# Altium schematic sheet P19 Connect.SchDoc
size 420 x 297 mm
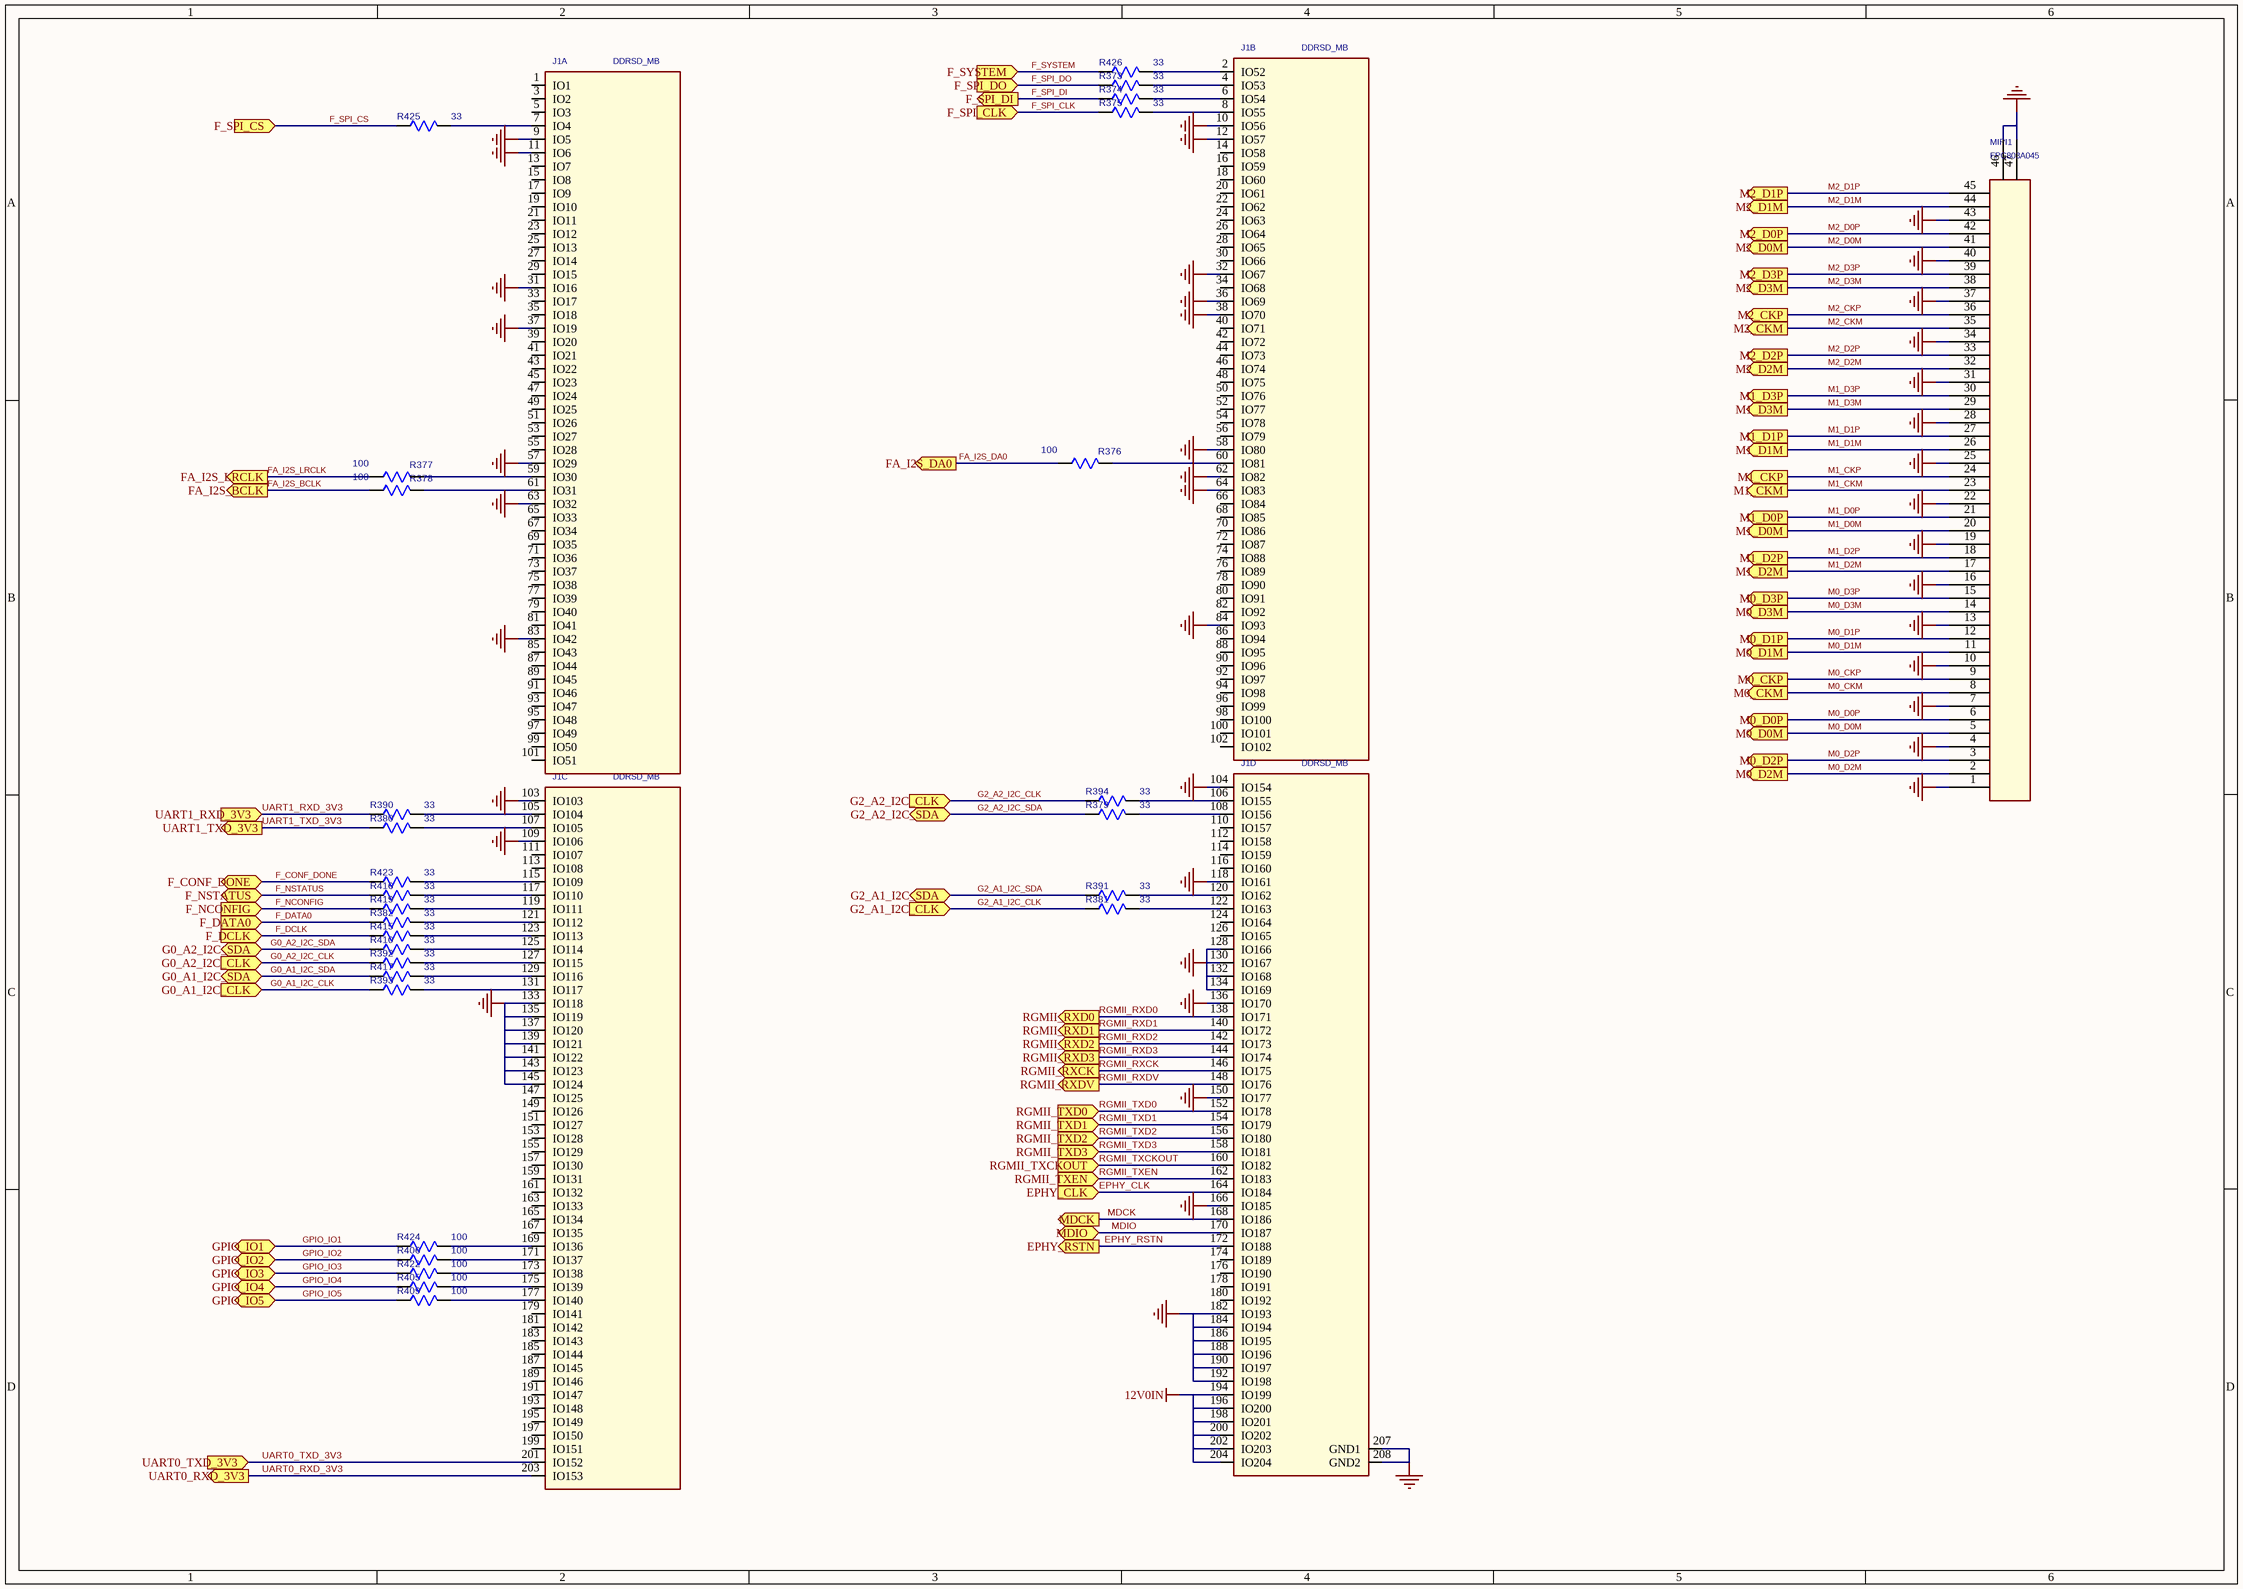
[diagram p0: P19 Connect.SchDoc]

## Parts
J1  DDRSD_MB  [DDR3SODI_MBH2S6]  (parts A,B,C,D of 4)
MIPI1  FPC803A045  [FPC803A045]
R373  33  [SR0402]
R374  33  [SR0402]
R375  33  [SR0402]
R376  100  [SR0402]
R377  100  [SR0402]
R378  100  [SR0402]
R379  33  [SR0402]
R380  33  [SR0402]
R381  33  [SR0402]
R382  33  [SR0402]
R390  33  [SR0402]
R391  33  [SR0402]
R392  33  [SR0402]
R393  33  [SR0402]
R394  33  [SR0402]
R405  100  [SR0402]
R406  100  [SR0402]
R409  100  [SR0402]
R410  33  [SR0402]
R415  33  [SR0402]
R416  33  [SR0402]
R417  33  [SR0402]
R419  33  [SR0402]
R422  100  [SR0402]
R423  33  [SR0402]
R424  100  [SR0402]
R425  33  [SR0402]
R426  33  [SR0402]

## Ports
EPHY_CLK, EPHY_RSTN, F_CONF_DONE, F_DATA0, F_DCLK, F_NCONFIG, F_NSTATUS, F_SPI_CLK, F_SPI_CS, F_SPI_DI, F_SPI_DO, F_SYSTEM, FA_I2S_BCLK, FA_I2S_DA0, FA_I2S_LRCLK, G0_A1_I2C_CLK, G0_A1_I2C_SDA, G0_A2_I2C_CLK, G0_A2_I2C_SDA, G2_A1_I2C_CLK, G2_A1_I2C_SDA, G2_A2_I2C_CLK, G2_A2_I2C_SDA, GPIO_IO1, GPIO_IO2, GPIO_IO3, GPIO_IO4, GPIO_IO5, M0_CKM, M0_CKP, M0_D0M, M0_D0P, M0_D1M, M0_D1P, M0_D2M, M0_D2P, M0_D3M, M0_D3P, M1_CKM, M1_CKP, M1_D0M, M1_D0P, M1_D1M, M1_D1P, M1_D2M, M1_D2P, M1_D3M, M1_D3P, M2_CKM, M2_CKP, M2_D0M, M2_D0P, M2_D1M, M2_D1P, M2_D2M, M2_D2P, M2_D3M, M2_D3P, MDCK, MDIO, RGMII_RXCK, RGMII_RXD0, RGMII_RXD1, RGMII_RXD2, RGMII_RXD3, RGMII_RXDV, RGMII_TXCKOUT, RGMII_TXD0, RGMII_TXD1, RGMII_TXD2, RGMII_TXD3, RGMII_TXEN, UART0_RXD_3V3, UART0_TXD_3V3, UART1_RXD_3V3, UART1_TXD_3V3

## Nets
12V0IN: J1.194(IO199) J1.196(IO200) J1.198(IO201) J1.200(IO202) J1.202(IO203) J1.204(IO204)
GND: J1.9(IO5) J1.10(IO56) J1.11(IO6) J1.12(IO57) J1.31(IO16) J1.32(IO67) J1.36(IO69) J1.37(IO19) J1.38(IO70) J1.57(IO29) J1.58(IO80) J1.62(IO82) J1.63(IO32) J1.64(IO83) J1.83(IO42) J1.84(IO93) J1.103(IO103) J1.104(IO154) J1.109(IO106) J1.118(IO161) J1.128(IO166) J1.130(IO167) J1.132(IO168) J1.133(IO118) J1.134(IO169) J1.135(IO119) J1.136(IO170) J1.137(IO120) J1.139(IO121) J1.141(IO122) J1.143(IO123) J1.145(IO124) J1.150(IO177) J1.166(IO185) J1.182(IO193) J1.184(IO194) J1.186(IO195) J1.188(IO196) J1.190(IO197) J1.192(IO198) J1.207(GND1) J1.208(GND2) MIPI1.1 MIPI1.4 MIPI1.7 MIPI1.10 MIPI1.13 MIPI1.16 MIPI1.19 MIPI1.22 MIPI1.25 MIPI1.28 MIPI1.31 MIPI1.34 MIPI1.37 MIPI1.40 MIPI1.43 MIPI1.46 MIPI1.47
EPHY_CLK: J1.164(IO184) ; port EPHY_CLK
EPHY_RSTN: J1.172(IO188) ; port EPHY_RSTN
F_CONF_DONE: R423.1(A) ; port F_CONF_DONE
F_DATA0: R382.1(A) ; port F_DATA0
F_DCLK: R415.1(A) ; port F_DCLK
F_NCONFIG: R419.1(A) ; port F_NCONFIG
F_NSTATUS: R416.1(A) ; port F_NSTATUS
F_SPI_CLK: R375.1(A) ; port F_SPI_CLK
F_SPI_CS: R425.1(A) ; port F_SPI_CS
F_SPI_DI: R374.1(A) ; port F_SPI_DI
F_SPI_DO: R373.1(A) ; port F_SPI_DO
F_SYSTEM: R426.1(A) ; port F_SYSTEM
FA_I2S_BCLK: R378.2(B) ; port FA_I2S_BCLK
FA_I2S_DA0: R376.2(B) ; port FA_I2S_DA0
FA_I2S_LRCLK: R377.2(B) ; port FA_I2S_LRCLK
G0_A1_I2C_CLK: R393.1(A) ; port G0_A1_I2C_CLK
G0_A1_I2C_SDA: R417.1(A) ; port G0_A1_I2C_SDA
G0_A2_I2C_CLK: R392.1(A) ; port G0_A2_I2C_CLK
G0_A2_I2C_SDA: R410.1(A) ; port G0_A2_I2C_SDA
G2_A1_I2C_CLK: R381.1(A) ; port G2_A1_I2C_CLK
G2_A1_I2C_SDA: R391.1(A) ; port G2_A1_I2C_SDA
G2_A2_I2C_CLK: R394.1(A) ; port G2_A2_I2C_CLK
G2_A2_I2C_SDA: R379.1(A) ; port G2_A2_I2C_SDA
GPIO_IO1: R424.1(A) ; port GPIO_IO1
GPIO_IO2: R406.1(A) ; port GPIO_IO2
GPIO_IO3: R422.1(A) ; port GPIO_IO3
GPIO_IO4: R405.1(A) ; port GPIO_IO4
GPIO_IO5: R409.1(A) ; port GPIO_IO5
M0_CKM: MIPI1.8 ; port M0_CKM
M0_CKP: MIPI1.9 ; port M0_CKP
M0_D0M: MIPI1.5 ; port M0_D0M
M0_D0P: MIPI1.6 ; port M0_D0P
M0_D1M: MIPI1.11 ; port M0_D1M
M0_D1P: MIPI1.12 ; port M0_D1P
M0_D2M: MIPI1.2 ; port M0_D2M
M0_D2P: MIPI1.3 ; port M0_D2P
M0_D3M: MIPI1.14 ; port M0_D3M
M0_D3P: MIPI1.15 ; port M0_D3P
M1_CKM: MIPI1.23 ; port M1_CKM
M1_CKP: MIPI1.24 ; port M1_CKP
M1_D0M: MIPI1.20 ; port M1_D0M
M1_D0P: MIPI1.21 ; port M1_D0P
M1_D1M: MIPI1.26 ; port M1_D1M
M1_D1P: MIPI1.27 ; port M1_D1P
M1_D2M: MIPI1.17 ; port M1_D2M
M1_D2P: MIPI1.18 ; port M1_D2P
M1_D3M: MIPI1.29 ; port M1_D3M
M1_D3P: MIPI1.30 ; port M1_D3P
M2_CKM: MIPI1.35 ; port M2_CKM
M2_CKP: MIPI1.36 ; port M2_CKP
M2_D0M: MIPI1.41 ; port M2_D0M
M2_D0P: MIPI1.42 ; port M2_D0P
M2_D1M: MIPI1.44 ; port M2_D1M
M2_D1P: MIPI1.45 ; port M2_D1P
M2_D2M: MIPI1.32 ; port M2_D2M
M2_D2P: MIPI1.33 ; port M2_D2P
M2_D3M: MIPI1.38 ; port M2_D3M
M2_D3P: MIPI1.39 ; port M2_D3P
MDCK: J1.168(IO186) ; port MDCK
MDIO: J1.170(IO187) ; port MDIO
RGMII_RXCK: J1.146(IO175) ; port RGMII_RXCK
RGMII_RXD0: J1.138(IO171) ; port RGMII_RXD0
RGMII_RXD1: J1.140(IO172) ; port RGMII_RXD1
RGMII_RXD2: J1.142(IO173) ; port RGMII_RXD2
RGMII_RXD3: J1.144(IO174) ; port RGMII_RXD3
RGMII_RXDV: J1.148(IO176) ; port RGMII_RXDV
RGMII_TXCKOUT: J1.160(IO182) ; port RGMII_TXCKOUT
RGMII_TXD0: J1.152(IO178) ; port RGMII_TXD0
RGMII_TXD1: J1.154(IO179) ; port RGMII_TXD1
RGMII_TXD2: J1.156(IO180) ; port RGMII_TXD2
RGMII_TXD3: J1.158(IO181) ; port RGMII_TXD3
RGMII_TXEN: J1.162(IO183) ; port RGMII_TXEN
UART0_RXD_3V3: J1.203(IO153) ; port UART0_RXD_3V3
UART0_TXD_3V3: J1.201(IO152) ; port UART0_TXD_3V3
UART1_RXD_3V3: R390.1(A) ; port UART1_RXD_3V3
UART1_TXD_3V3: R380.1(A) ; port UART1_TXD_3V3
NetJ1_2: J1.2(IO52) R426.2(B)
NetJ1_4: J1.4(IO53) R373.2(B)
NetJ1_6: J1.6(IO54) R374.2(B)
NetJ1_7: J1.7(IO4) R425.2(B)
NetJ1_8: J1.8(IO55) R375.2(B)
NetJ1_59: J1.59(IO30) R377.1(A)
NetJ1_60: J1.60(IO81) R376.1(A)
NetJ1_61: J1.61(IO31) R378.1(A)
NetJ1_105: J1.105(IO104) R390.2(B)
NetJ1_106: J1.106(IO155) R394.2(B)
NetJ1_107: J1.107(IO105) R380.2(B)
NetJ1_108: J1.108(IO156) R379.2(B)
NetJ1_115: J1.115(IO109) R423.2(B)
NetJ1_117: J1.117(IO110) R416.2(B)
NetJ1_119: J1.119(IO111) R419.2(B)
NetJ1_120: J1.120(IO162) R391.2(B)
NetJ1_121: J1.121(IO112) R382.2(B)
NetJ1_122: J1.122(IO163) R381.2(B)
NetJ1_123: J1.123(IO113) R415.2(B)
NetJ1_125: J1.125(IO114) R410.2(B)
NetJ1_127: J1.127(IO115) R392.2(B)
NetJ1_129: J1.129(IO116) R417.2(B)
NetJ1_131: J1.131(IO117) R393.2(B)
NetJ1_169: J1.169(IO136) R424.2(B)
NetJ1_171: J1.171(IO137) R406.2(B)
NetJ1_173: J1.173(IO138) R422.2(B)
NetJ1_175: J1.175(IO139) R405.2(B)
NetJ1_177: J1.177(IO140) R409.2(B)

Not connected (* = marked no-connect by the designer): J1 1(IO1) 3(IO2) 5(IO3) 13(IO7) 14(IO58) 15(IO8) 16(IO59) 17(IO9) 18(IO60) 19(IO10) 20(IO61) 21(IO11) 22(IO62) 23(IO12) 24(IO63) 25(IO13) 26(IO64) 27(IO14) 28(IO65) 29(IO15) 30(IO66) 33(IO17) 34(IO68) 35(IO18) 39(IO20) 40(IO71) 41(IO21) 42(IO72) 43(IO22) 44(IO73) 45(IO23) 46(IO74) 47(IO24) 48(IO75) 49(IO25) 50(IO76) 51(IO26) 52(IO77) 53(IO27) 54(IO78) 55(IO28) 56(IO79) 65(IO33) 66(IO84) 67(IO34) 68(IO85) 69(IO35) 70(IO86) 71(IO36) 72(IO87) 73(IO37) 74(IO88) 75(IO38) 76(IO89) 77(IO39) 78(IO90) 79(IO40) 80(IO91) 81(IO41) 82(IO92) 85(IO43) 86(IO94) 87(IO44) 88(IO95) 89(IO45) 90(IO96) 91(IO46) 92(IO97) 93(IO47) 94(IO98) 95(IO48) 96(IO99) 97(IO49) 98(IO100) 99(IO50) 100(IO101) 101(IO51) 102(IO102) 110(IO157) 111(IO107) 112(IO158) 113(IO108) 114(IO159) 116(IO160) 124(IO164) 126(IO165) 147(IO125) 149(IO126) 151(IO127) 153(IO128) 155(IO129) 157(IO130) 159(IO131) 161(IO132) 163(IO133) 165(IO134) 167(IO135) 174(IO189) 176(IO190) 178(IO191) 179(IO141) 180(IO192) 181(IO142) 183(IO143) 185(IO144) 187(IO145) 189(IO146) 191(IO147) 193(IO148) 195(IO149) 197(IO150) 199(IO151)

## Library data of the parts
J1 = DDRSD_MB_2: SPLIT_INST: TRUE; SWAP_INFO: (S1+S2+S3+S4)
MIPI1 = CON40_0
R373-R375 R382 R405 R406 R409 R415 R419 R422 R424 R426 = R_1: PARTS: 1; OriginalSymbolOrigin: (10,20); PINSWAP: (A,B); DEVICE: RC0402FR_0733RL; LEVEL: STD; %208%%161%%192%%224%%195%%251%%179%%198%: 片式厚膜电阻器; COMPONENT_HIGH_MAX: 0.4MM; %215%%232%%214%%181%%212%%202%%208%%237%%198%%171%%178%%238%: +/-1%; %182%%238%%182%%168%%185%%166%%194%%202%(W): 0.06; %195%%232%%202%%246%: 片式厚膜电阻器-0.0625W-33OHM-+/-1%-0402; CODE: 7090836; PKG_TYPE: SR0402
R376 R377 = R_1: PARTS: 1; OriginalSymbolOrigin: (10,20); PINSWAP: (A,B); DEVICE: RK73B1ELTP472J; LEVEL: STD; %208%%161%%192%%224%%195%%251%%179%%198%: 片式厚膜电阻器; COMPONENT_HIGH_MAX: 0.4MM; %215%%232%%214%%181%%212%%202%%208%%237%%198%%171%%178%%238%: +/-5%; %182%%238%%182%%168%%185%%166%%194%%202%(W): 0.06; %195%%232%%202%%246%: 片式厚膜电阻器-0.0625W-4700OHM-+/-5%-0402-BT; CODE: 7090793; PKG_TYPE: SR0402
R378 = R_1: PARTS: 1; OriginalSymbolOrigin: (10,20); PINSWAP: (A,B); DEVICE: RK73B1ELTP472J; LEVEL: STD; CODE: 7090793; %195%%232%%202%%246%: 片式厚膜电阻器-0.0625W-4700OHM-+/-5%-0402-BT; %182%%238%%182%%168%%185%%166%%194%%202%(W): 0.06; %215%%232%%214%%181%%212%%202%%208%%237%%198%%171%%178%%238%: +/-5%; COMPONENT_HIGH_MAX: 0.4MM; %208%%161%%192%%224%%195%%251%%179%%198%: 片式厚膜电阻器; PKG_TYPE: SR0402
R379-R381 R390-R394 R410 R416 R417 R423 R425 = R_1: PARTS: 1; OriginalSymbolOrigin: (10,20); PINSWAP: (A,B); DEVICE: RC0402FR_0733RL; LEVEL: STD; CODE: 7090836; %195%%232%%202%%246%: 片式厚膜电阻器-0.0625W-33OHM-+/-1%-0402; %182%%238%%182%%168%%185%%166%%194%%202%(W): 0.06; %215%%232%%214%%181%%212%%202%%208%%237%%198%%171%%178%%238%: +/-1%; COMPONENT_HIGH_MAX: 0.4MM; %208%%161%%192%%224%%195%%251%%179%%198%: 片式厚膜电阻器; PKG_TYPE: SR0402